# EasyEDA Pro project ProProject_【常亮24天】 低功耗-迷你桌面时钟_2024-08-04.epro, board 桌面便携时钟4.0.3-控制板
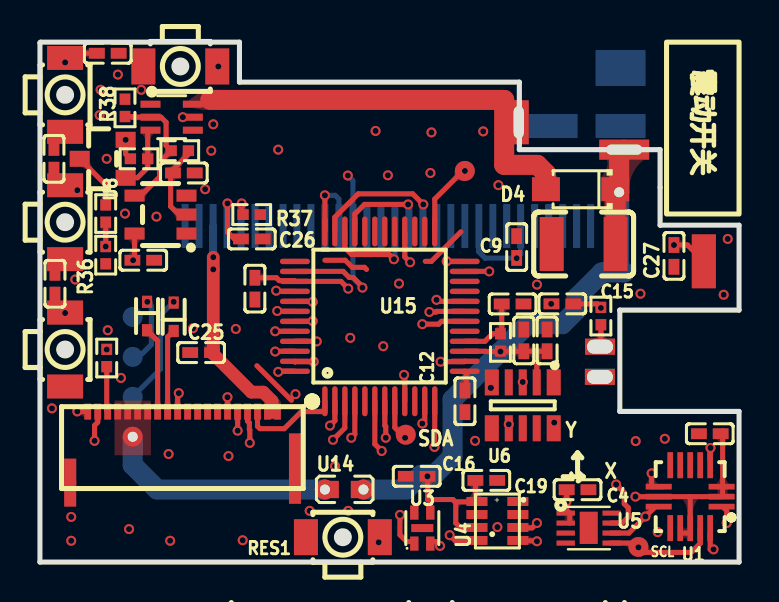
[diagram p4: board, top side]
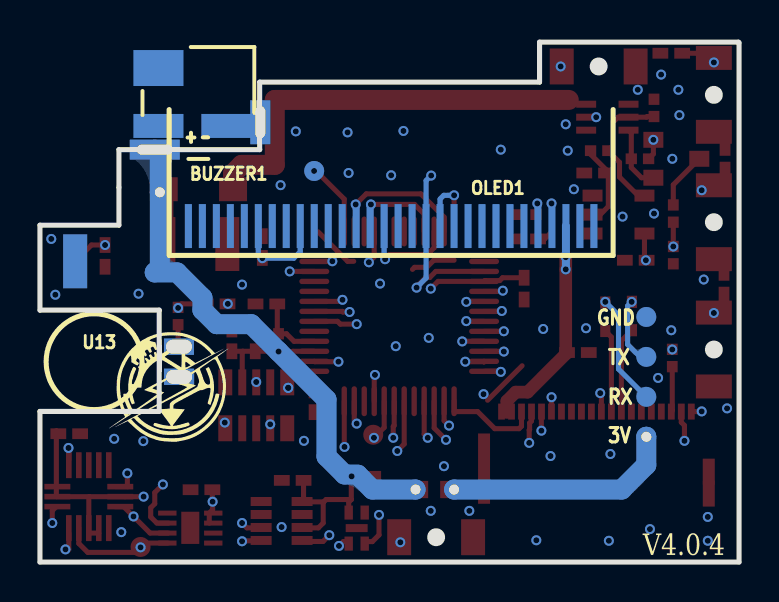
[diagram p5: board, bottom side, seen from below]

Outline 35 x 26.03 mm; copper layers: Top Layer, Inner1, Inner2, Bottom Layer. Coordinates in mm from the lower left corner of the outline.
Outline path: 0,26 0.03,26.03 9.99,26.03 9.99,24.03 24,24.03 24,20.65 31.05,20.65 31.05,16.87 35,16.87 35,12.62 29.03,12.62 29.03,7.54 35,7.54 35,0 0,0 0,26
Stack: Top Layer 0.035mm / Dielectric1 0.48mm PP er 4.5 / Inner1 0.035mm / Dielectric2 0.48mm FR4 er 4.5 / Inner2 0.035mm / Dielectric3 0.48mm PP er 4.5 / Bottom Layer 0.035mm

## Design rules (mm)
template: 用户自定义配置
spacing Default (default): track to track 0.152, other pairs 0 to 0.152
spacing 极限: track to track 0.152, other pairs 0 to 0.152
track width Default (default): min 0.15, default 0.15, max 25.4
track width 极限: min 0.15, default 0.15, max 25.4
differential pair differentialPair (default): width min 0.127, default 0.254, max 2.54; gap min 0.152, default 0.152
via Default (default): diameter min 0.499, default 0.599, max 100.025; hole min 0.3, default 0.3, max 59.995
via 极限: diameter min 0.61, default 0.61, max 100.025; hole min 0.3, default 0.3, max 59.995
net GND uses gge190816

## Placement (name value [footprint] x y rotation side)
BUZZER1  FST-5018  [buz-smd_fst-5018]  27.07 22.99 180 bottom
C1  10nF  [C0402]  25.39 11.1 90 top
C4  100nF  [C0402]  26.91 3.62 180 top
C5  100nF  [C0402]  24.22 11.1 90 top
C6  10uF  [C0402]  23.66 12.92 180 top
C9  100nF  [C0402]  23.87 15.77 270 top
C12  100nF  [C0402]  21.28 8.05 270 top
C14  10nF  [C0402]  10.76 13.69 90 top
C15  47uF  [C1210]  27.22 15.92 0 top
C16  100nF  [C0402]  18.86 4.29 0 top
C17  10nF  [C0402]  3.39 25.48 180 top
C18  10nF  [C0402]  0.7 20.19 270 top
C19  100nF  [C0402]  22.35 4.09 180 top
C20  10nF  [C0402]  0.75 13.94 270 top
C21  100nF  [C0402]  33.53 6.43 0 top
C22  100nF  [C0402]  5.17 15.11 0 top
C23  100nF  [C0402]  7.2 19.48 180 top
C24  10uF  [C0402]  26.15 12.93 0 top
C25  10uF  [C0402]  8.07 10.49 0 top
C26  10uF  [C0402]  10.61 16.18 0 top
C27  100nF  [C0402]  31.74 15.33 90 top
D2  RB520G-30  [SOD-723_L1.7-W1.0-P1.42-RD]  5.36 12.32 270 top
D3  RB520G-30  [SOD-723_L1.7-W1.0-P1.42-RD]  6.7 12.28 90 top
D4  DS34W  [SOD-123FL_L2.7-W1.8-LS3.8-RD]  27.07 18.67 180 top
KEY+1  TS-1063S-B3D4  [KEY-SMD_L3.0-W2.5-LS4.0_TS-1603S]  1.26 17.02 270 top
KEY-  TS-1063S-B3D4  [KEY-SMD_L3.0-W2.5-LS4.0_TS-1603S]  1.26 23.39 270 top
KEYSET1  TS-1063S-B3D4  [KEY-SMD_L3.0-W2.5-LS4.0_TS-1603S]  1.26 10.64 270 top
MOD  TS-1063S-B3D4  [KEY-SMD_L3.0-W2.5-LS4.0_TS-1603S]  7.03 24.81 180 top
NOREF  -  [Pad_e712]  33.24 15.06 180 top
NOREF#2  -  [Pad_e41]  4.64 10.27 270 top
NOREF#3  -  [Pad_e10]  1.52 4.53 180 top
NOREF#4  -  [Pad_e13]  11.89 7.53 180 top
NOREF#5  -  [Pad_e1520]  14.27 3.63 270 top
NOREF#6  -  [Pad_e81]  4.39 7.53 180 top
NOREF#7  -  [Pad_e62]  10.39 7.53 180 top
NOREF#8  -  [Pad_e70]  7.39 7.53 180 top
NOREF#9  -  [Pad_e69]  8.39 7.53 180 top
NOREF#10  -  [Pad_e83]  3.39 7.53 180 top
NOREF#11  -  [Pad_e1820]  29 18.52 270 top
NOREF#12  -  [Pad_e78]  4.89 7.53 180 top
NOREF#13  -  [Pad_e714]  29.96 0.76 270 top
NOREF#14  -  [Pad_e84]  2.39 7.53 180 top
NOREF#15  -  [Pad_e56]  11.39 7.53 180 top
NOREF#16  -  [Pad_e239]  16.2 3.63 270 top
NOREF#17  -  [Pad_e713]  18.31 6.37 270 top
NOREF#18  -  [Pad_e202]  1.51 3.43 180 top
NOREF#19  -  [Pad_e131]  33.24 15.06 180 top
NOREF#20  -  [Pad_e79]  5.39 7.53 180 top
NOREF#21  -  [Pad_e43]  4.64 12.27 270 top
NOREF#22  -  [Pad_e72]  6.39 7.53 180 top
NOREF#23  -  [Pad_e63]  8.89 7.53 180 top
NOREF#24  -  [Pad_e380]  28.03 9.27 0 top
NOREF#25  -  [Pad_e82]  2.89 7.53 180 top
NOREF#26  -  [Pad_e85]  5.89 7.53 180 top
NOREF#27  -  [Pad_e401]  28.04 10.78 0 top
NOREF#28  -  [Pad_e91]  4.64 6.27 270 top
NOREF#29  -  [Pad_e68]  7.89 7.53 180 top
NOREF#30  -  [Pad_e67]  9.39 7.53 180 top
NOREF#31  -  [Pad_e61]  9.89 7.53 180 top
NOREF#32  -  [Pad_e71]  6.89 7.53 180 top
NOREF#33  -  [Pad_e12]  12.77 5.14 180 top
NOREF#34  -  [Pad_e42]  4.64 8.27 270 top
NOREF#35  -  [Pad_e312]  21.27 19.58 270 top
NOREF#36  -  [Pad_e260]  21.27 19.58 270 top
NOREF#37  -  [Pad_e193]  23.97 22.02 0 top
NOREF#38  -  [Pad_e57]  10.89 7.53 180 top
NOREF#39  -  [Pad_e80]  3.89 7.53 180 top
NOREF#40  -  [Pad_e1815]  29.25 20.65 270 top
NOREF#41  -  [Pad_e203]  12.77 3.57 180 top
OLED1  OLED_SSD13063  [OLED_SSD1306_1.3]  17.42 15.67 180 bottom
Q4  AO3401A  [SOT-23_L2.9-W1.3-P0.95-LS2.4-BR]  3.14 20.19 0 top
Q5  DMN3190LDW-7  [sc-70-6_l2.2-w1.3-p0.65-ls2.1-bl]  6.59 22.28 270 top
R2  2kΩ  [R0402]  28.08 12.32 90 top
R4  100K  [R0402]  3.29 17.45 90 top
R5  100K  [R0402]  3.29 15.37 90 top
R6  11kΩ  [R0402]  4.96 20.19 180 top
R7  68kΩ  [R0402]  7 20.6 0 top
R26  100  [R0402]  23.05 11 90 top
R36  1.1MΩ  [R0402]  3.34 10.22 270 top
R37  51kΩ  [R0402]  10.6 17.4 0 top
R38  1.1MΩ  [R0402]  4.26 22.74 270 top
RES1  TS-1063S-B3D4  [KEY-SMD_L3.0-W2.5-LS4.0_TS-1603S]  15.17 1.24 0 top
U1  BMC050  [lga-16_l3.0-w3.0-p0.50-tl-1]  32.55 3.28 180 top
U3  SHT40-AD1B-R2  [dfn-4_l1.5-w1.5-p0.80-tl-ep]  19.14 1.7 90 top
U4  SPL06-001  [sensor-smd_spl06-001]  22.9 2.06 90 top
U5  BH1745NUC-E2  [wson-8_l2.0-w2.0-p0.50-tl-ep]  27.47 1.7 0 top
U6  INS5699S  [smd-10_l3.2-w2.5-p0.70-bl_dapu_ins5699s]  24.17 7.85 180 top
U8  SN74LVC1G14DBVR  [SOT-23-5_L3.0-W1.7-P0.95-LS2.8-BR]  6.04 17.4 0 top
U13  MS412FE-FL26E  [bat-smd_ms412fe-fl26e]  28.54 10.03 180 bottom
U14  BLM18PG121SN1D  [L0603]  15.26 3.63 0 top
U15  STC32F12K54-64I-LQFP48  [LQFP-48_L7.0-W7.0-P0.50-LS9.0-BL]  17.01 12.3 0 top

## Footprints (pads in the part's own frame, mm; a bottom-side part is the same pattern mirrored in y, then rotated)
bat-smd_ms412fe-fl26e
  rect 1.5x0.8 smd: 1(0.5,0.75) 2(0.5,-0.75)
buz-smd_fst-5018
  rect 2.5x1.2 smd: 1(-2,-1.149) 2(1.4,-1.149)
  rect 2.5x1.8 smd: 3(-2,1.75)
C0402
  rect 0.79x0.54 smd: 1(-0.545,0) 2(0.545,0)
C1210
  rect 1.2x2.7 smd: 1(-1.6,0) 2(1.6,0)
dfn-4_l1.5-w1.5-p0.80-tl-ep
  rect 0.705x0.42 smd: 1(-0.777,0.4) 2(-0.777,-0.4) 3(0.777,-0.4) 4(0.777,0.4)
  rect 0.4x1.1 smd: 5(0,0)
KEY-SMD_L3.0-W2.5-LS4.0_TS-1603S
  rect 1.2x1.8 smd: 1(-1.85,0) 2(1.85,0)
L0603
  rect 0.8x0.864 smd: 1(-0.7,0) 2(0.7,0)
lga-16_l3.0-w3.0-p0.50-tl-1
  rect 1.3x0.28 smd: 1(-1.575,0.5) 2(-1.575,0) 3(-1.575,-0.5) 9(1.575,-0.5) 10(1.575,0) 11(1.575,0.5)
  rect 0.28x1.3 smd: 4(-1,-1.574) 5(-0.5,-1.574) 6(-0.001,-1.574) 7(0.5,-1.574) 8(1,-1.574) 12(1,1.576) 13(0.5,1.576) 14(-0.001,1.576) 15(-0.5,1.576) 16(-1,1.576)
LQFP-48_L7.0-W7.0-P0.50-LS9.0-BL
  oval 0.27x1.5 smd: 1(-2.75,-4.25) 2(-2.25,-4.25) 3(-1.75,-4.25) 4(-1.25,-4.25) 5(-0.75,-4.25) 6(-0.25,-4.25) 7(0.25,-4.25) 8(0.75,-4.25) 9(1.25,-4.25) 10(1.75,-4.25) 11(2.25,-4.25) 12(2.75,-4.25) 25(2.75,4.25) 26(2.25,4.25) 27(1.75,4.25) 28(1.25,4.25) 29(0.75,4.25) 30(0.25,4.25) 31(-0.25,4.25) 32(-0.75,4.25) 33(-1.25,4.25) 34(-1.75,4.25) 35(-2.25,4.25) 36(-2.75,4.25)
  oval 1.5x0.27 smd: 13(4.25,-2.75) 14(4.25,-2.25) 15(4.25,-1.75) 16(4.25,-1.25) 17(4.25,-0.75) 18(4.25,-0.25) 19(4.25,0.25) 20(4.25,0.75) 21(4.25,1.25) 22(4.25,1.75) 23(4.25,2.25) 24(4.25,2.75) 37(-4.25,2.75) 38(-4.25,2.25) 39(-4.25,1.75) 40(-4.25,1.25) 41(-4.25,0.75) 42(-4.25,0.25) 43(-4.25,-0.25) 44(-4.25,-0.75) 45(-4.25,-1.25) 46(-4.25,-1.75) 47(-4.25,-2.25) 48(-4.25,-2.75)
OLED_SSD1306_1.3
  rect 0.35x2.2 smd: 1(-10.15,1.153) 2(-9.45,1.153) 3(-8.75,1.153) 4(-8.05,1.153) 5(-7.35,1.153) 6(-6.65,1.153) 7(-5.95,1.153) 8(-5.25,1.153) 9(-4.55,1.153) 10(-3.85,1.153) 11(-3.15,1.153) 12(-2.45,1.153) 13(-1.75,1.153) 14(-1.05,1.153) 15(-0.35,1.153) 16(0.35,1.153) 17(1.05,1.153) 18(1.75,1.153) 19(2.45,1.153) 20(3.15,1.153) 21(3.85,1.153) 22(4.55,1.153) 23(5.25,1.153) 24(5.95,1.153) 25(6.65,1.153) 26(7.35,1.153) 27(8.05,1.153) 28(8.75,1.153) 29(9.45,1.153) 30(10.15,1.153)
Pad_e10
  rect 0.6x1.3 smd: 1(0,0)
Pad_e12
  rect 0.6x2.6 smd: 1(0,0)
Pad_e13
  rect 0.34x0.8 smd: 1(0,0)
Pad_e41
  round 1 smd far side: 8(0,0)
Pad_e42
  round 1 smd far side: 8(0,0)
Pad_e43
  round 1 smd far side: 8(0,0)
Pad_e56
  rect 0.34x0.8 smd: 1(0,0)
Pad_e57
  rect 0.34x0.8 smd: 1(0,0)
Pad_e61
  rect 0.34x0.8 smd: 1(0,0)
Pad_e62
  rect 0.34x0.8 smd: 1(0,0)
Pad_e63
  rect 0.34x0.8 smd: 1(0,0)
Pad_e67
  rect 0.34x0.8 smd: 1(0,0)
Pad_e68
  rect 0.34x0.8 smd: 1(0,0)
Pad_e69
  rect 0.34x0.8 smd: 1(0,0)
Pad_e70
  rect 0.34x0.8 smd: 1(0,0)
Pad_e71
  rect 0.34x0.8 smd: 1(0,0)
Pad_e72
  rect 0.34x0.8 smd: 1(0,0)
Pad_e78
  rect 0.34x0.8 smd: 1(0,0)
Pad_e79
  rect 0.34x0.8 smd: 1(0,0)
Pad_e80
  rect 0.34x0.8 smd: 1(0,0)
Pad_e81
  rect 0.34x0.8 smd: 1(0,0)
Pad_e82
  rect 0.34x0.8 smd: 1(0,0)
Pad_e83
  rect 0.34x0.8 smd: 1(0,0)
Pad_e84
  rect 0.34x0.8 smd: 1(0,0)
Pad_e85
  rect 0.34x0.8 smd: 1(0,0)
Pad_e91
  round 1 hole 0.5: 2(0,0)
Pad_e131
  rect 1.2x2.7 smd far side: 2(0,0)
Pad_e193
  rect 1x2.2 hole 0.5x1.6: 1(0,0)
Pad_e202
  rect 0.6x1.3 smd: 1(0,0)
Pad_e203
  rect 0.6x1.3 smd: 1(0,0)
Pad_e239
  round 1 hole 0.5: 2(0,0)
Pad_e260
  round 1 smd: 2(0,0)
Pad_e312
  round 1 smd far side: 2(0,0)
Pad_e380
  rect 1.5x0.8 hole 1.3x0.7: 49(0,0)
Pad_e401
  rect 1.5x0.8 hole 1.3x0.7: 49(0,0)
Pad_e712
  rect 1.2x2.7 smd: 2(0,0)
Pad_e713
  round 1 smd: 2(0,0)
Pad_e714
  round 1 smd: 2(0,0)
Pad_e1520
  round 1 hole 0.5: 2(0,0)
Pad_e1815
  rect 1x2.5 hole 0.5x1.8: 1(0,0)
Pad_e1820
  round 1 hole 0.5: 2(0,0)
R0402
  rect 0.566x0.54 smd: 1(-0.433,0) 2(0.433,0)
sc-70-6_l2.2-w1.3-p0.65-ls2.1-bl
  rect 0.35x1 smd: 1(-0.65,-1.06) 2(0,-1.06) 3(0.65,-1.06) 4(0.65,1.06) 5(0,1.06) 6(-0.65,1.06)
sensor-smd_spl06-001
  rect 0.45x1.05 smd: 1(0.975,-1.025) 2(0.325,-1.025) 3(-0.325,-1.025) 4(-0.975,-1.025) 5(-0.975,1.025) 6(-0.325,1.025) 7(0.325,1.025) 8(0.975,1.025)
smd-10_l3.2-w2.5-p0.70-bl_dapu_ins5699s
  rect 0.7x1.3 smd: 1(-1.55,-1.15) 5(1.55,-1.15) 6(1.55,1.15) 10(-1.55,1.15)
  rect 0.4x1.3 smd: 2(-0.7,-1.15) 3(0,-1.15) 4(0.7,-1.15) 7(0.7,1.15) 8(0,1.15) 9(-0.7,1.15)
SOD-123FL_L2.7-W1.8-LS3.8-RD
  rect 1.4x1.2 smd: 1(-1.735,0) 2(1.735,0)
SOD-723_L1.7-W1.0-P1.42-RD
  rect 0.61x0.508 smd: 1(0.711,0) 2(-0.711,0)
SOT-23-5_L3.0-W1.7-P0.95-LS2.8-BR
  rect 1x0.6 smd: 1(1.3,-0.95) 2(1.3,0) 3(1.3,0.95) 4(-1.3,0.95) 5(-1.3,-0.95)
SOT-23_L2.9-W1.3-P0.95-LS2.4-BR
  rect 1x0.8 smd: 1(1.15,-0.95) 2(1.15,0.95) 3(-1.15,0)
wson-8_l2.0-w2.0-p0.50-tl-ep
  rect 0.921x0.25 smd: 1(-1.15,0.75) 2(-1.15,0.25) 3(-1.15,-0.25) 4(-1.15,-0.75) 5(1.15,-0.75) 6(1.15,-0.25) 7(1.15,0.25) 8(1.15,0.75)
  rect 0.901x1.613 smd: 9(0,0.013)

## Nets
5V: C25.2 NOREF#4.1 NOREF#15.1 OLED1.28
5VEN: NOREF#38.1 U15.1
GND: C1.2 C4.1 C5.2 C6.1 C9.1 C12.2 C14.1 C15.1 C16.1 C17.1 C18.1 C19.1 C20.1 C21.1 C22.2 C23.1 C24.1 C25.1 C26.2 C27.1 KEY+1.2 KEY-.2 KEYSET1.2 MOD.2 NOREF#8.1 NOREF#9.1 NOREF#19.2 NOREF#21.8 NOREF#23.1 NOREF#24.49 NOREF#29.1 NOREF#33.1 NOREF#41.1 OLED1.1 OLED1.8 OLED1.10 OLED1.11 OLED1.12 OLED1.16 OLED1.17 OLED1.21 OLED1.22 OLED1.23 OLED1.24 OLED1.25 OLED1.29 OLED1.30 Q5.1 Q5.4 R5.1 R37.2 R38.1 RES1.1 U1.6 U1.7 U1.8 U1.12 U3.4 U4.1 U4.7 U5.3 U5.9 U6.1 U6.9 U8.3 U13.2 U15.17
3.3: BUZZER1.1 C1.1 C4.2 C5.1 C15.2 C16.2 C19.2 C21.2 D4.1 NOREF#11.2 NOREF#16.2 NOREF#40.1 R26.1 U1.2 U1.3 U1.10 U1.13 U1.14 U3.3 U4.6 U4.8 U5.1 U5.2 U6.2 U14.2 U15.15
3.3_INT: NOREF#5.2 NOREF#6.1 NOREF#12.1 NOREF#20.1 NOREF#28.2 NOREF#39.1 U14.1
ADC6: NOREF#30.1 U15.46
BATTERY: R4.1 R5.2 U15.47
BATTERY_ON: Q5.5 U15.48
BH_INT: U5.7 U15.6
BVIN+: NOREF#14.1 Q4.2 R6.2
CCP0: Q5.2 R7.1 R38.2 U8.4
CCP0_EN: C22.1 U8.5 U15.18
CS: OLED1.13 U15.35
DC: OLED1.15 U15.34
DRDYO: U1.9 U15.7
EN: NOREF#25.1 U15.45
ENIN: RES1.2 U15.14
GHRG: NOREF#10.1 R36.2
GHRG_1: R36.1 U15.44
INT2O: U1.1 U15.12
INT3: U1.16 U15.28
INT3O: U1.4 U15.11
KEY+: C18.2 KEY+1.1 U15.41
KEY-: C17.2 KEY-.1 U15.40
KEYMODE: C14.2 MOD.1 U15.39
KEYSET: C20.2 KEYSET1.1 U15.42
MOSI: OLED1.19 U15.36
OLEDV1: NOREF#7.1 U15.3
OLEDV2: NOREF#31.1 U15.2
RSE: OLED1.14 U15.33
RX: D2.1 NOREF#26.1
SCL: NOREF#13.2 U1.15 U3.2 U4.4 U5.5 U6.5 U15.9
SCLK: OLED1.18 U15.38
SDA: NOREF#17.2 U1.11 U3.1 U4.3 U5.6 U6.7 U15.8
SPL06_INT: U4.5 U15.4
SQW: U6.10 U15.24
SW360: C27.2 NOREF.2 U15.23
TEXT: NOREF#35.2 NOREF#36.2 U15.25
TX: D3.2 NOREF#22.1
VIN/2: NOREF#32.1 U15.43
VREF: C6.2 R26.2 U15.16
$1N379: C26.1 OLED1.27
$1N1002: C23.2 R7.2 U8.2
$1N1213: C9.2 OLED1.6 OLED1.9
$1N32098: C12.1 U15.13
$1N32104: D2.2 NOREF#2.8 U15.20
$1N50115: BUZZER1.2 D4.2 NOREF#37.1 Q5.6
$1N50119: Q4.1 Q5.3 R6.1
$1N50124: Q4.3 R4.2
$1N56259: D3.1 NOREF#34.8 U15.19
$1N64340: OLED1.26 R37.1
$1N70472: C24.2 R2.2 U6.3
$1N70477: NOREF#27.49 R2.1 U13.1

Pads without a net: BUZZER1 3; NOREF#3 1; NOREF#18 1; OLED1 2 3 4 5 7 20; U1 5; U3 5; U4 2; U5 4 8; U6 4 6 8; U8 1; U15 5 10 21 22 26 27 29 30 31 32 37

## Via types
v1: diameter 0.5, hole 0.305, Top Layer to Bottom Layer, 118 vias
v2: diameter 0.5, hole 0.3, Top Layer to Bottom Layer, 8 vias

## Routing (per net, layer and track width the routed paths; a pad name or vN(x,y) marks a point on that pad's centre or on a via; arc(x,y) is an arc through that point)
5V: length 11.5
  Top Layer w0.635: 11.62,7.49 11.62,8.06 11.18,8.51 10.58,8.51 8.66,10.43 8.68,10.44 v1(8.68,14.66) v1(8.68,15.26)
  Bottom Layer w0.4: 8.67,16.82 8.67,14.66 v1(8.68,14.66)
5VEN: length 5
  Top Layer w0.254: NOREF#38.1 10.89,6.8 11.01,6.68 12.23,6.68 13.09,7.53 14.27,7.53 U15.1
GND: length 7.1
  Top Layer w0.254: 19.29,15.06 19.6,15.06 21.07,16.53 ; 10.86,9.83 12.59,8.1 ; 16.35,14.66 16.25,14.76 15.64,14.76 15.28,15.11 14.27,15.11
  vias: v1(0.6,7.7) v1(1.57,2.26) v1(1.57,1.07) v1(1.77,14.15) v1(2.99,22.38) v1(3.04,23.65) v1(3.34,20.19) v1(3.39,11.61) v1(3.9,24.41) v1(4.05,9.22) v1(4.26,17.45) v1(4.46,1.65) v1(5.07,23.65) v1(5.83,17.3) v1(6.44,5.41) v1(6.52,1.07) v1(7.66,11.71) v1(8.27,18.67) v1(8.58,20.6) v1(8.68,21.92) v1(9.44,5.31) v1(9.81,11.67) v1(10.15,1.09) v1(11.93,20.65) v1(12.79,8.41) v1(13.5,2.56) v1(14.77,4.8) v1(15.43,2.56) v1(15.54,11.23) v1(16.8,21.59) v1(17.19,10.81) v1(17.42,19.37) v1(17.97,13.94) v1(19.6,21.51) v1(19.55,19.48) v1(21.78,6.07) v1(22.19,21.56) v1(22.9,1.75) v1(22.95,18.87) v1(24.88,13.89) v1(25.59,12.93) v1(30.06,13.44) v1(30.93,1.5) v1(31.28,6.17) v1(34.23,13.39) v1(34.43,16.18)
3.3: length 79.2
  Top Layer w0.254: 26.37,3.62 26.37,3.03 26.36,3.02 26.36,2.62 26.52,2.45 26.52,1.95 ; 20.79,3.01 20.68,3.13 19.41,3.13 ; 20.79,3.01 21.75,3.01 ; 20.79,3.01 20.82,2.99 20.82,1.95 21.06,1.71 22.16,1.71 22.18,1.73 ; 19.41,3.13 19.41,4.39 19.4,4.37 v1(19.4,4.29) ; 19.41,3.13 19.54,3 19.54,2.38 ; 32.53,3.27 34.18,3.27 34.18,6.58 ; 32.53,3.27 32.55,3.25 32.55,1.45 32.05,1.45 ; 32.53,3.27 v1(29.81,3.27) ; 21.75,3.01 21.8,3.07 C19.2 ; 21.75,3.01 22.16,3.01 22.18,3.03 ; 21.75,3.01 21.72,2.98 ; U15.15 22.33,10.55 22.35,10.54 v1(23.05,10.54) 23.08,10.54 23.09,10.55 C5.1 24.85,10.55 ; C1.1 24.85,10.55 ; 24.85,10.55 24.87,10.53 U6.2 ; 26.37,3.62 C4.2
  Top Layer w1: NOREF#40.1 29,20.4 NOREF#11.2 28.82,18.34 C15.2
  Inner1 w0.381: v1(19.4,4.29) 20.67,3.02 v1(26.36,3.02) 26.61,3.28 v1(29.81,3.28)
  Inner2 w0.381: v1(19.4,4.29) 24.42,4.29 25.7,3.02 v1(26.36,3.02) 26.61,3.28 v1(29.81,3.28)
  Bottom Layer w0.8: 19.01,4.29 18.88,4.16
  Bottom Layer w1: NOREF#40.1 29,20.4 NOREF#11.2 29,14.76 29.25,14.5 28.13,14.5 26.86,13.23 26.86,12.62 26.15,11.91 24.42,11.91 v1(23.05,10.54) 20.65,8.14 20.65,5.29 19.75,4.39 19.09,4.37 18.88,4.16 18.35,3.63 NOREF#16.2
3.3_INT: length 11.5
  Bottom Layer w1: NOREF#5.2 5.87,3.63 4.64,4.86 NOREF#28.2
ADC6: length 5.4
  Top Layer w0.254: U15.46 11.89,10.55 11.88,10.54 v1(11.78,10.54) ; NOREF#30.1 9.39,8.25 v1(9.39,8.25)
  Inner2 w0.178: v1(9.39,8.25) 9.39,8.87 11.06,10.54 11.77,10.54
BATTERY: length 16.2
  Top Layer w0.254: v1(3.29,15.8) R4.1 ; U15.47 12.76,10.02 12.78,10.03 v1(13.71,10.03)
  Inner1 w0.178: v1(3.29,15.8) 3.29,13.79 7.05,10.03 v1(13.71,10.03)
BATTERY_ON: length 22.7
  Top Layer w0.178: v1(7.15,22.28) 7.03,22.28
  Top Layer w0.254: v1(11.93,9.52) 11.96,9.55 12.76,9.55 ; v1(7.15,22.28) 7.65,22.28
  Inner1 w0.254: v1(7.15,22.28) 7.15,21.92 2.76,17.53 2.76,13.75 6.98,9.52 v1(11.93,9.52)
BH_INT: length 18
  Top Layer w0.254: v1(28.84,3.89) 29.25,3.48 29.25,2.92 29.45,2.72 29.45,2.26 29.15,1.95 28.57,1.95 ; 16.76,8.05 16.76,5.91 v1(17.11,5.56)
  Inner1 w0.254: v1(28.84,3.89) 28.79,3.94 20.51,3.94 19.63,4.82 17.85,4.82 v1(17.11,5.56)
BVIN+: length 16.2
  Top Layer w0.254: v1(1.87,7.54) 1.88,7.53 NOREF#14.1 ; v1(4.29,21.14) 4.29,20.43 R6.2
  Inner1 w0.254: v1(1.87,7.54) 2.36,8.03 2.36,17.73 4.29,19.67 v1(4.29,21.14)
CCP0: length 6.9
  Top Layer w0.254: 4.73,18.35 5.05,18.35 5.98,19.28 5.98,20.02 6.57,20.6 6.31,20.85 6.31,22.02 6.06,22.28 4.63,22.28 4.59,22.31 4.26,22.31
CCP0_EN: length 19.7
  Top Layer w0.152: C22.1 4.73,15.22
  Top Layer w0.254: 21.27,12.05 20.1,12.05 19.96,11.91 v1(19.14,11.91) ; 4.73,15.22 U8.5
  Inner2 w0.254: v1(4.66,15.11) 5.54,14.24 7.2,14.24 7.66,13.78 11.15,13.78 11.61,14.24 13.31,14.24 15.64,11.91 v1(19.14,11.91)
CS: length 6.9
  Top Layer w0.254: U15.35 14.77,17.27 15.93,18.44 18.66,18.44 v1(19.19,17.91)
  Bottom Layer w0.254: OLED1.13 19.17,17.88 v1(19.19,17.91)
DC: length 5.2
  Top Layer w0.254: v1(17.72,15.16) 17.49,15.4 15.61,15.4 15.26,15.74 15.26,16.55
  Bottom Layer w0.254: v1(17.72,15.16) 17.77,15.21 17.77,16.82
DRDYO: length 17.2
  Top Layer w0.254: v1(17.31,6.22) 17.31,6.79 17.27,6.83 17.27,8.05 ; v1(30.62,4.44) 30.62,3.8 30.6,3.78 31.23,3.78
  Inner1 w0.254: v1(17.31,6.22) 18.31,5.23 19.93,5.23 20.72,4.44 30.62,4.44
EN: length 15.8
  Top Layer w0.254: v1(2.73,6.07) 2.73,6.84 2.89,7 NOREF#25.1 ; U15.45 13.85,11.05 13.86,11.05
  Inner2 w0.178: v1(2.73,6.07) 4.08,7.42 7.47,7.42 11.1,11.05 v1(13.86,11.05)
ENIN: length 13.5
  Top Layer w0.254: v1(20.06,10.03) 21.24,10.03 U15.14
  Inner2 w0.254: v1(16.96,0.99) 16.96,1.43 17.06,1.53 17.06,4.19 16.11,5.13 16.11,8.07 18.08,10.03 20.06,10.03
GHRG: length 2.3
  Top Layer w0.254: R36.2 3.34,7.58 NOREF#10.1
GHRG_1: length 13.3
  Top Layer w0.254: v1(11.78,11.56) 11.78,11.55 12.76,11.55
  Inner2 w0.178: v1(3.34,10.64) 3.34,8.62 4.16,7.8 7.39,7.8 11.14,11.56 v1(11.78,11.56)
INT2O: length 19.4
  Top Layer w0.254: 34.18,2.78 34.38,2.57 v1(34.38,1.95) ; 19.76,8.05 19.76,5.78 19.75,5.77
  Inner1 w0.254: 19.75,5.77 20.11,5.77 20.9,4.97 31.16,4.97 34.18,1.95 34.38,1.95
  vias: v1(19.75,5.77)
INT3: length 28.3
  Top Layer w0.254: U15.28 18.27,15.28 v1(18.53,15.01) ; 33.55,1.45 33.55,0.63 v1(33.72,0.63)
  Inner1 w0.254: v1(18.53,15.01) 18.91,15.01 20.92,13 20.92,8.31 23.17,6.06 v2(29.82,6.06)
  Inner2 w0.254: v1(33.72,0.63) 33.72,3.58 32.15,5.16 30.72,5.16 v2(29.82,6.06)
INT3O: length 17.1
  Top Layer w0.254: 33.55,5.1 33.55,5.7 v1(33.57,5.71) ; v1(19.14,6.93) 19.21,6.93 19.26,6.88 19.26,8.05
  Inner1 w0.254: 33.57,5.71 33.25,5.39 21.25,5.39 20.47,6.17 20.11,6.17 19.95,6.32 19.75,6.32 v1(19.14,6.93)
KEY+: length 16.1
  Top Layer w0.254: 13.66,13.03 13.63,13.05 U15.41
  Inner2 w0.178: v1(1.87,18.62) 3.83,16.66 3.83,14.73 5.04,13.52 6.93,13.52 7.37,13.08 13.6,13.08 v1(13.66,13.03)
KEY-: length 22.4
  Top Layer w0.254: U15.40 11.86,13.55 v1(11.83,13.59) ; v1(1.26,25.02) 1.72,25.48 C17.2
  Inner2 w0.178: v1(11.83,13.59) 11.65,13.41 7.5,13.41 7.06,13.85 5.21,13.85 4.16,14.91 4.16,16.8 2.43,18.53 2.43,23.85 v1(1.26,25.02)
KEYMODE: length 28
  Top Layer w0.254: 15.43,13.69 15.07,14.05 U15.39 12.72,14.09 11.98,14.09 11.84,14.23 C14.2
  Inner2 w0.178: v1(8.93,24.81) 8.17,24.81 5.22,21.87 5.22,15.21 5.83,14.61 7.35,14.61 7.81,14.15 10.96,14.15 11.42,14.61 ; 11.42,14.61 13.46,14.61 14.38,13.69 v1(15.43,13.69) ; 11.42,14.61 11.67,14.61
KEYSET: length 11.6
  Top Layer w0.254: 11.88,12.57 11.9,12.55 12.76,12.55
  Inner2 w0.178: v1(1.26,12.47) 11.78,12.47 v1(11.88,12.57)
MOSI: length 3.9
  Top Layer w0.254: v1(14.27,18.36) U15.36
  Bottom Layer w0.254: 14.97,16.82 14.97,18.18 14.78,18.36 v1(14.27,18.36)
OLEDV1: length 8
  Top Layer w0.254: 15.26,8.05 15.26,6.71 v1(14.67,6.12) ; v1(10.51,5.97) 10.51,6.61 10.48,6.63 10.48,6.97 10.39,7.06 NOREF#7.1
  Inner1 w0.254: v1(10.51,5.97) 10.66,6.12 v1(14.67,6.12)
OLEDV2: length 7
  Top Layer w0.254: NOREF#31.1 9.9,7.53 v1(9.9,6.58) ; 14.77,8.05 14.77,7.08 v1(14.52,6.83)
  Inner1 w0.254: v1(9.9,6.58) 14.26,6.58 v1(14.52,6.83)
RSE: length 4.8
  Top Layer w0.254: U15.33 15.76,17.42 16.25,17.91 18.43,17.91
  Bottom Layer w0.254: 18.43,17.91 18.47,17.87 18.47,16.82
  vias: v1(18.43,17.91)
RX: length 4.3
  Top Layer w0.254: D2.1 5.89,11.08 NOREF#26.1
SCL: length 35.5
  Top Layer w0.254: NOREF#13.2 29.77,0.95 28.57,0.95 ; 23.63,1.08 23.64,1.06 24.86,1.06 v1(24.88,1.04) ; 18.26,8.05 18.26,9.33 v1(18.23,9.37) ; 19.54,1.02 19.81,1.02 v1(20.03,0.81) ; v1(29.96,0.74) 30.22,0.48 32.6,0.48 33.05,0.93 33.05,1.7
  Inner2 w0.254: 18.23,9.37 16.52,7.67 16.52,5.34 17.47,4.39 17.47,1.29 17.95,0.81 20.03,0.81 ; v2(22.57,8.72) 21.92,9.37 v1(18.23,9.37) ; v1(20.03,0.81) 22.49,0.81 22.72,1.04 29.66,1.04 v1(29.96,0.74)
SCLK: length 9.7
  Top Layer w0.254: U15.38 15.18,14.55 15.48,14.25 15.69,14.25 16.14,13.79 v1(16.14,13.74)
  Bottom Layer w0.254: v1(16.14,13.74) 15.67,14.22 OLED1.18 15.67,19.1 v2(15.41,19.35)
SDA: length 31.7
  Top Layer w0.254: v1(18.02,2.36) 18.02,1.36 18.36,1.02 18.74,1.02 ; 28.57,1.45 29.48,1.45 v1(30.32,2.28) ; 23.63,1.73 23.64,1.71 24.64,1.71 v1(24.88,1.95) ; v1(18.28,6.22) 17.77,6.74 17.77,8.05 ; 31.23,2.78 30.81,2.78 30.32,2.28
  Inner2 w0.254: v1(30.32,2.28) 29.99,1.95 v1(24.88,1.95) 24.88,2.03 24.55,2.36 v1(18.02,2.36) 18.02,4.5 18.28,4.75 v1(18.28,6.22) 18.28,7.09 18.84,7.64 22.72,7.64 v2(23.47,6.9)
SPL06_INT: length 10.9
  Top Layer w0.254: 15.59,6.22 15.76,6.4 15.76,8.05 ; 22.18,1.08 22.13,1.03 20.83,1.03 20.51,1.34
  Inner1 w0.254: v1(20.51,1.35) 20.06,1.35 15.59,5.82 v1(15.59,6.22)
SQW: length 12.6
  Top Layer w0.254: U15.24 20.37,15.05 v1(20.36,15.06)
  Inner1 w0.254: v1(20.36,15.06) 21.38,14.05 21.38,9.07 22.75,7.7 24.53,7.7 25.24,6.98 v1(25.75,6.98)
SW360: length 12.9
  Top Layer w0.254: v1(31.74,15.87) 32.42,15.87 NOREF.2 ; v1(22.49,14.55) U15.23
  Inner1 w0.254: 31.74,15.87 30.45,14.58 22.52,14.58 v1(22.49,14.55)
TEXT: length 3.7
  Top Layer w0.254: v2(21.28,19.58) 21.17,19.58 19.76,18.17 U15.25
TX: length 4.2
  Top Layer w0.254: NOREF#22.1 6.39,11.27 D3.2
VIN/2: length 10
  Top Layer w0.254: v1(6.95,8.46) 6.89,8.4 NOREF#32.1 ; v1(13.66,12.06) 13.64,12.05 12.76,12.05
  Inner2 w0.178: v1(13.66,12.06) 11.18,12.06 7.58,8.46 v1(6.95,8.46)
VREF: length 3.5
  Top Layer w0.254: C6.2 23.12,11.49 R26.2 22.66,11.43 22.28,11.05 U15.16
$1N379: length 3.4
  Top Layer w0.254: C26.1 9.73,16.18 9.39,16.53 v1(9.39,17.96)
  Bottom Layer w0.254: v1(9.39,17.96) 9.37,17.94 9.37,16.82
$1N1002: length 4.1
  Top Layer w0.254: R7.2 7.43,20.42 6.66,19.65 C23.2 6.54,19.37 6.54,17.8 6.95,17.4 U8.2
$1N1213: length 5
  Bottom Layer w0.254: OLED1.6 24.07,15.42 v2(23.87,15.21) 22.29,15.21 21.97,15.54 OLED1.9
$1N32098: length 0.9
  Top Layer w0.254: 21.34,8.66 21.34,9.48 U15.13
$1N32104: length 20.2
  Top Layer w0.254: v1(19.85,13.13) 19.93,13.05 U15.20
  Inner1 w0.254: v1(5.38,13.03) 6.04,13.69 10.44,13.69 11.3,14.55 13.71,14.55 15.13,13.13 v1(19.85,13.13)
  Bottom Layer w0.254: 4.96,10.27 5.58,10.9 5.58,12.83 v1(5.38,13.03)
$1N50115: length 21
  Top Layer w1: 8.52,23.14 23.24,23.14 23.24,19.89 24.9,19.89 25.33,19.46 D4.2
$1N50119: length 3.2
  Top Layer w0.254: 5.53,21.62 5.39,21.48 5.39,19.75 4.88,19.24 Q4.1
$1N50124: length 2.8
  Top Layer w0.254: R4.2 3.29,18.89 Q4.3
$1N56259: length 21.3
  Top Layer w0.254: v1(19.5,12.52) 19.83,12.52 19.87,12.55 21.27,12.55
  Inner1 w0.254: v1(19.5,12.52) 14.98,12.52 13.35,14.15 11.47,14.15 10.35,13.03 v1(6.7,13.03)
  Bottom Layer w0.254: NOREF#34.8 6.04,9.67 6.04,12.37 v1(6.7,13.03)
$1N64340: length 1.7
  Top Layer w0.254: 10.17,17.4 10.1,17.47 v1(10.1,17.96)
  Bottom Layer w0.254: 10.07,16.82 10.07,17.93 10.1,17.96
$1N70472: length 6.9
  Top Layer w0.254: R2.2 27.91,12.93 C24.2
  Inner1 w0.254: v1(24.17,9.02) 27.88,12.72 v2(28.08,12.72)
$1N70477: length 1.1
  Top Layer w0.254: R2.1 28.08,10.83 NOREF#27.49

## Copper pours and planes (outline as drawn; the poured copper is in the pictures)
5V on Top Layer: 11.22,8.51 12.06,8.51 12.06,7.14 11.22,7.14
GND on Top Layer: 0.03,26.03 35,26.03 35,0 0.03,0
GND on Bottom Layer: 0.03,26.03 35,26.03 35,0 0.03,0
GND on Inner1: 0.03,26.03 35,26.03 35,0 0.03,0
GND on Inner2: 0.03,26.05 35,26.05 35,0.01 0.03,0.01
3.3_INT on Top Layer: 3.73,8.09 5.55,8.09 5.55,5.35 3.73,5.35
$1N50115 on Top Layer: 7.2,23.65 8.93,23.65 8.93,22.63 7.2,22.63

Small or netless copper shapes (teardrops, artwork), in the pictures only: 190 on Top Layer, 23 on Bottom Layer, 33 on Inner1, 40 on Inner2

## Text on the board
Bottom Silkscreen Layer: TX | RX | 3V | GND | V4.0.4
Top Silkscreen Layer: SCL | Y | . | X | SDA | ↑ | 下单备注不做半孔工艺 | 震动开关
